# EAGLE design Hybrid Driver (EAGLE 8.5.2)
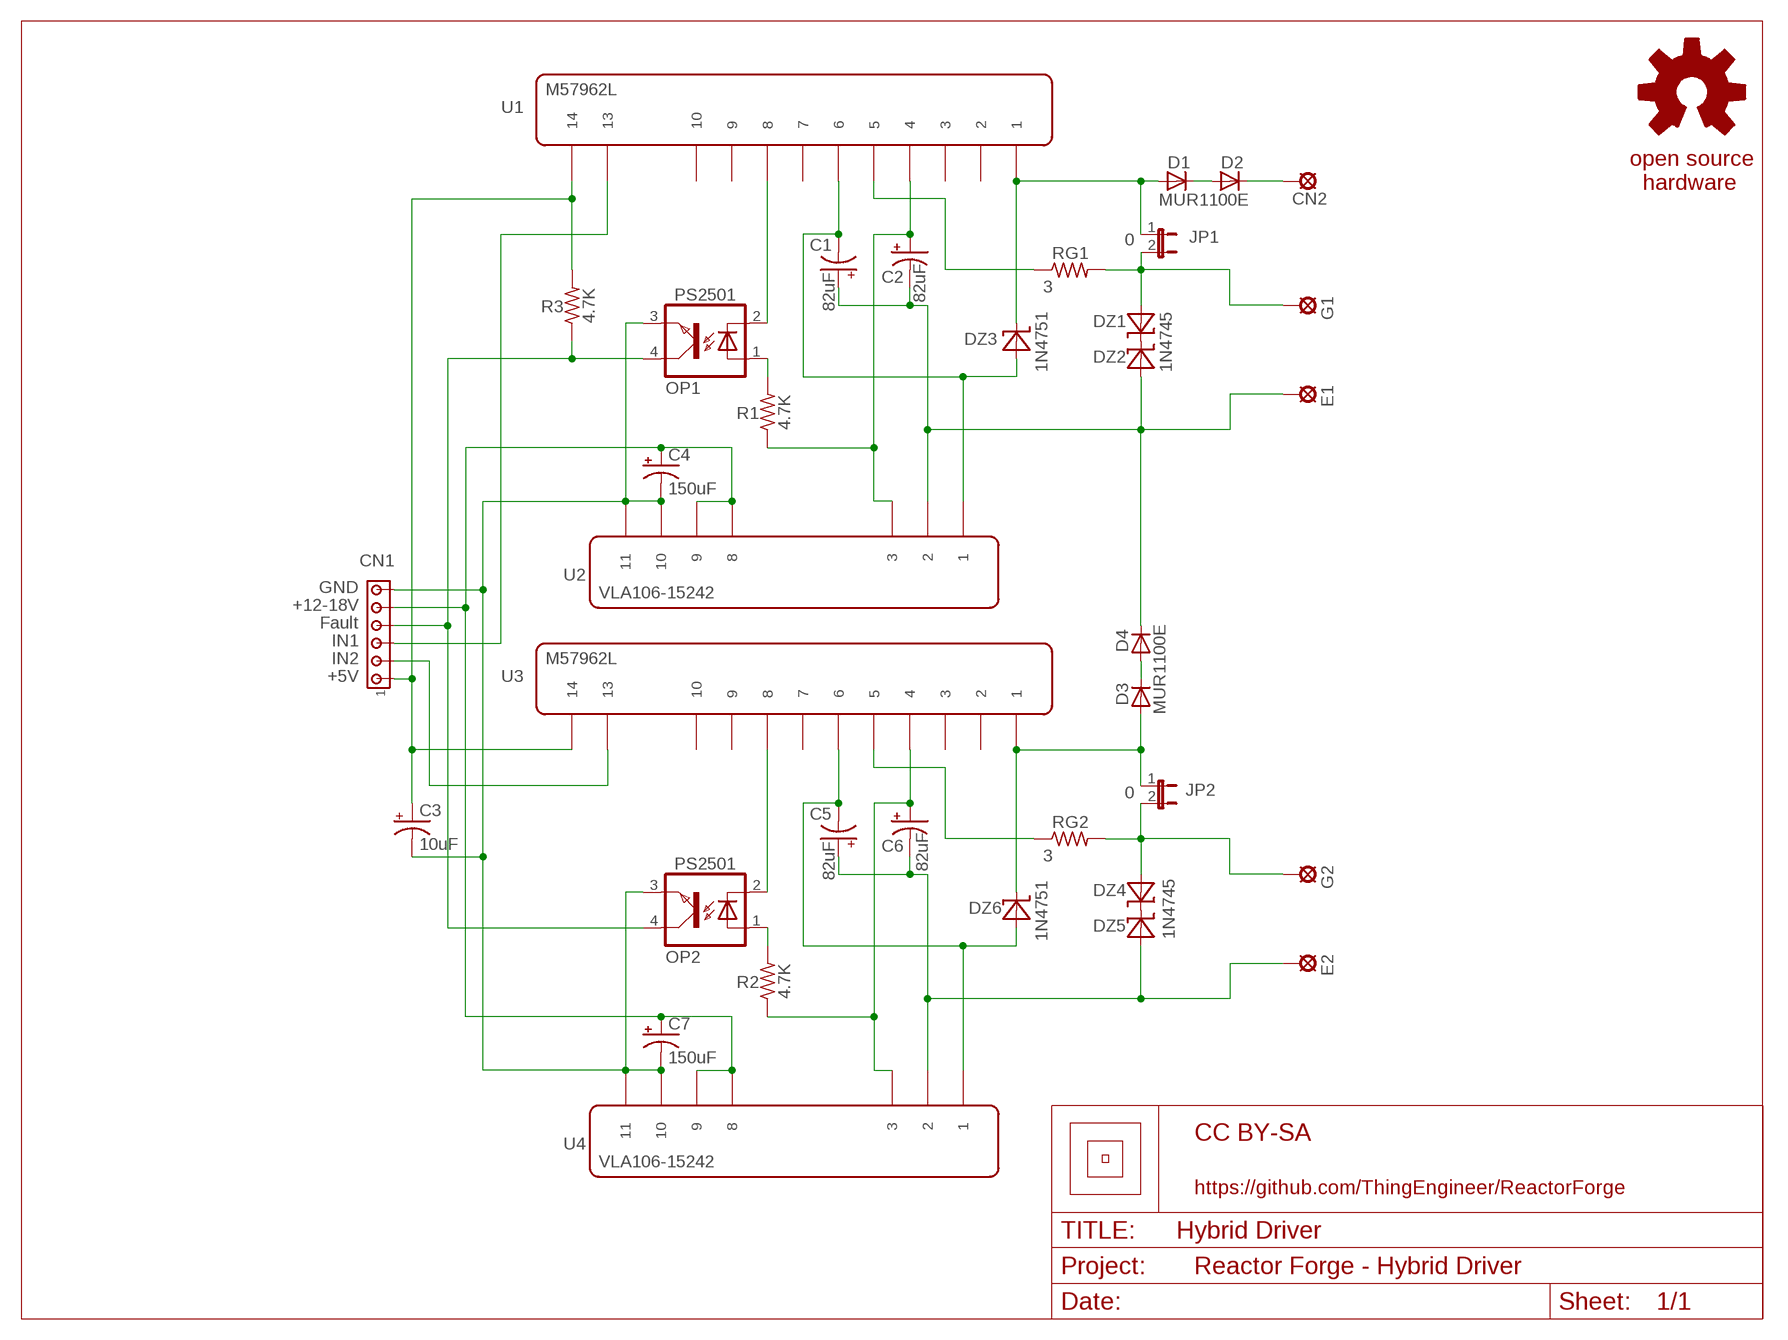
[diagram p0: schematic, sheet 1]
U$2 (LETTER_L): LICENSE: CC BY-SA; PROJECT: Reactor Forge - Hybrid Driver; URL: https://github.com/ThingEngineer/ReactorForge

## Parts
C1  82uF  CPOL-USE2.5-7  [E2,5-7]
C2  82uF  CPOL-USE2.5-7  [E2,5-7]
C3  10uF  CPOL-USE2-5  [E2-5]
C4  150uF  CPOL-USE5-8.5  [E5-8,5]
C5  82uF  CPOL-USE2.5-7  [E2,5-7]
C6  82uF  CPOL-USE2.5-7  [E2,5-7]
C7  150uF  CPOL-USE5-8.5  [E5-8,5]
CN1  MTA100-6  MTA06-100  [10X06MTA]
CN2  SE14  [SE14]
D1  MUR1100E  OA95  [DO07]
D2  MUR1100E  OA95  [DO07]
D3  MUR1100E  OA95  [DO07]
D4  MUR1100E  OA95  [DO07]
DZ1  1N4745  1N5338  [DIODE.4-AXIAL]
DZ2  1N4745  1N5338  [DIODE.4-AXIAL]
DZ3  1N4751  1N5338  [DIODE.4-AXIAL]
DZ4  1N4745  1N5338  [DIODE.4-AXIAL]
DZ5  1N4745  1N5338  [DIODE.4-AXIAL]
DZ6  1N4751  1N5338  [DIODE.4-AXIAL]
E1  IGBT-PAD  [IGBT-PAD]
E2  IGBT-PAD  [IGBT-PAD]
G1  IGBT-PAD  [IGBT-PAD]
G2  IGBT-PAD  [IGBT-PAD]
GOLD_ORB_SM1  OSHWLOGOLOGO8MM  [OSHW_8MM]
JP1  0  JP1E  [JP1]
JP2  0  JP1E  [JP1]
OP1  PS2501  PC817  [DIL04]
OP2  PS2501  PC817  [DIL04]
R1  4.7K  R-US_0207/10  [0207/10]
R2  4.7K  R-US_0207/10  [0207/10]
R3  4.7K  R-US_0207/10  [0207/10]
RG1  3  R-US_0309/12  [0309/12]
RG2  3  R-US_0309/12  [0309/12]
U1  M57962L  VLA504-01  [HYBRID-IC-IBGT-GATE-DRIVER]
U2  VLA106-15242  [ISOLATED_DC_DC_CONVERTER]
U3  M57962L  VLA504-01  [HYBRID-IC-IBGT-GATE-DRIVER]
U4  VLA106-15242  [ISOLATED_DC_DC_CONVERTER]

## Nets
G1: DZ1.A G1.1 G1.2 G1.3 G1.4 G1.5 G1.6 JP1.2 RG1.2
G2: DZ4.A G2.1 G2.2 G2.3 G2.4 G2.5 G2.6 JP2.2 RG2.2
GND: C3.- C4.- C7.- CN1.1 OP1.3(EMIT) OP2.3(EMIT) U2.10 U2.11 U4.10 U4.11
GND-E1: C1.+ C2.- D4.C DZ2.A E1.1 E1.2 E1.3 E1.4 E1.5 E1.6 U2.2
GND-E2: C5.+ C6.- DZ5.A E2.1 E2.2 E2.3 E2.4 E2.5 E2.6 U4.2
N$2: D1.C D2.A
N$3: CN2.MP D2.C
N$4: D1.A DZ3.C JP1.1 U1.1
N$6: OP2.1(A) R2.2
N$7: DZ1.C DZ2.C
N$8: DZ4.C DZ5.C
N$9: C3.+ CN1.6 R3.2 U1.14 U3.14
N$10: OP2.2(C) U3.8
N$11: OP1.2(C) U1.8
N$12: OP1.1(A) R1.2
N$13: CN1.3 OP1.4(COL) OP2.4(COL) R3.1
N$14 [power]: C5.- DZ6.A U3.6 U4.1
N$15 [power]: C1.- DZ3.A U1.6 U2.1
N$16: C2.+ R1.1 U1.4 U2.3
N$18: RG2.1 U3.5
N$19: C6.+ R2.1 U3.4 U4.3
N$21: RG1.1 U1.5
N$22: D3.A DZ6.C JP2.1 U3.1
N$25: D3.C D4.A
N$30 [power]: C4.+ C7.+ CN1.2 U2.8 U2.9 U4.8 U4.9
N$31: CN1.4 U1.13
N$32: CN1.5 U3.13
Unconnected: U1.2 U1.3 U1.7 U1.9 U1.10 U3.2 U3.3 U3.7 U3.9 U3.10

## Notes on the sheet
- GND
- +12-18V
- Fault
- IN1
- IN2
- +5V

## Library data of the parts
C1 C2 C4-C7 = resistor:CPOL-US: POLARIZED CAPACITOR, American symbol
C3 = rcl:CPOL-US: POLARIZED CAPACITOR, American symbol; SPICEPREFIX: C
CN1 = con-amp:MTA06-100: AMP connector
CN2 = solpad:SE14: SOLDER PAD E1553, drill 1,4mm, distributor Buerklin, 07F820
D1-D4 = diode:OA95: DIODE germanium diode 115 V, 50 mA/150 mA
DZ1-DZ6 = 1-Custom:1N5338: 1N5338 5.1V Zener Diode
E1 E2 G1 G2 = 1-Custom:IGBT-PAD
GOLD_ORB_SM1 = oshw:OSHWLOGO: The OSHW logo for PCB layout
JP1 JP2 = jumper:JP1E: JUMPER
OP1 OP2 = optocoupler:PC817: SHARP OPTO COUPLER; MPN: PC817X4J000F; OC_FARNELL: 9707727; OC_NEWARK: 97K7059
R1-R3 RG1 RG2 = resistor:R-US_: RESISTOR, American symbol
U1 U3 = 1-Custom:VLA504-01: VLA504-01 Hybrid IC IGBT Gate Driver 600V module up to 200A 1200V module up to 100A
U2 U4 = 1-Custom:VLA106-15242: VLA106-15252 Isolated DC/DC Converter Input: 12-18V Output: +24, 100mA (2.4W) 2500Vrms isolation

## Net classes
0 default: width 0.406 mm
1 power: width 0.508 mm

## Board
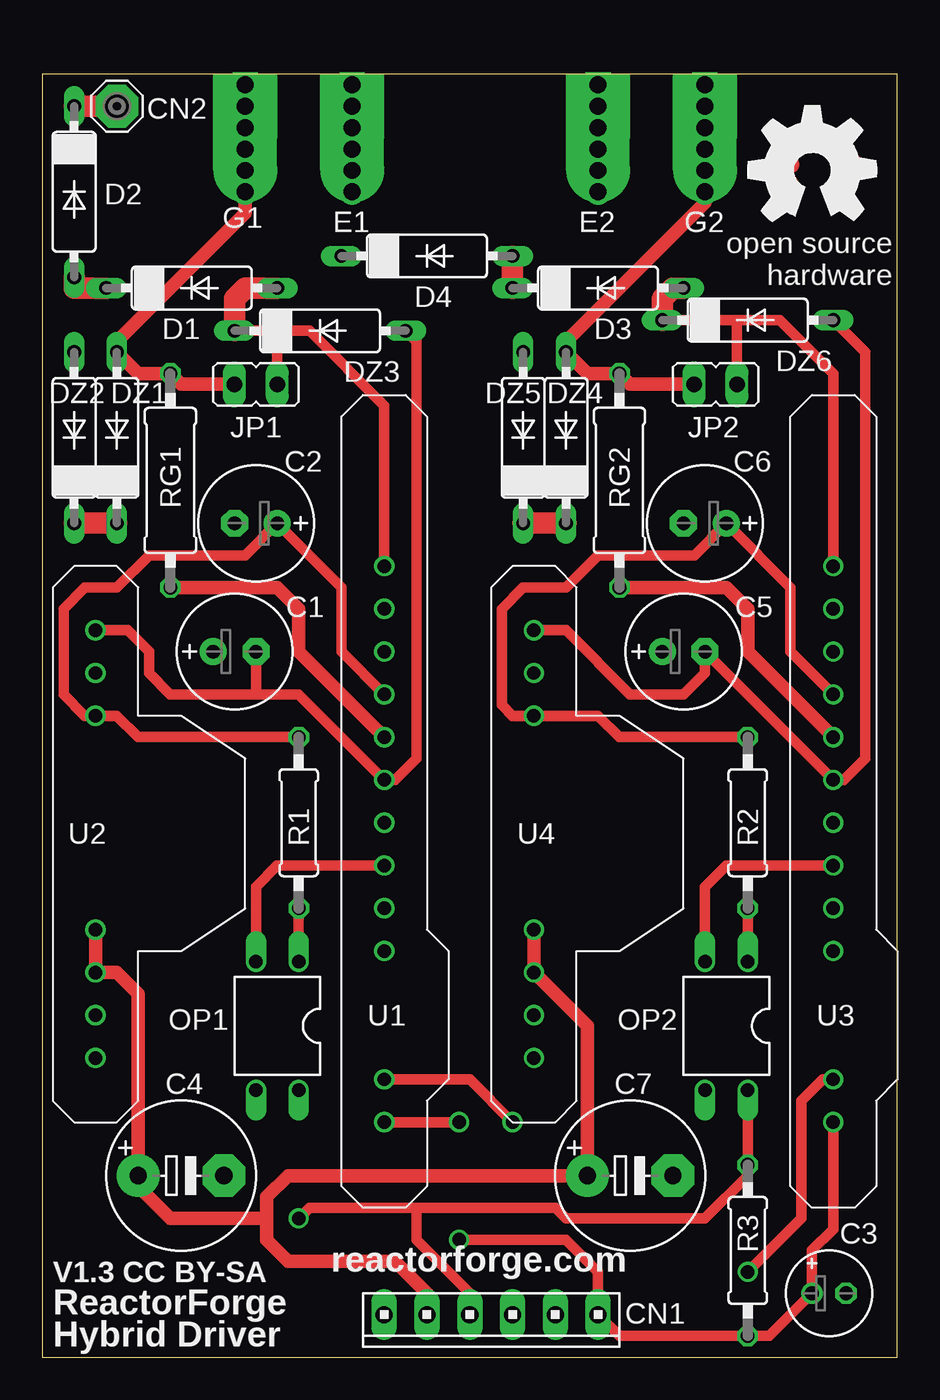
[diagram p1: board, top side]
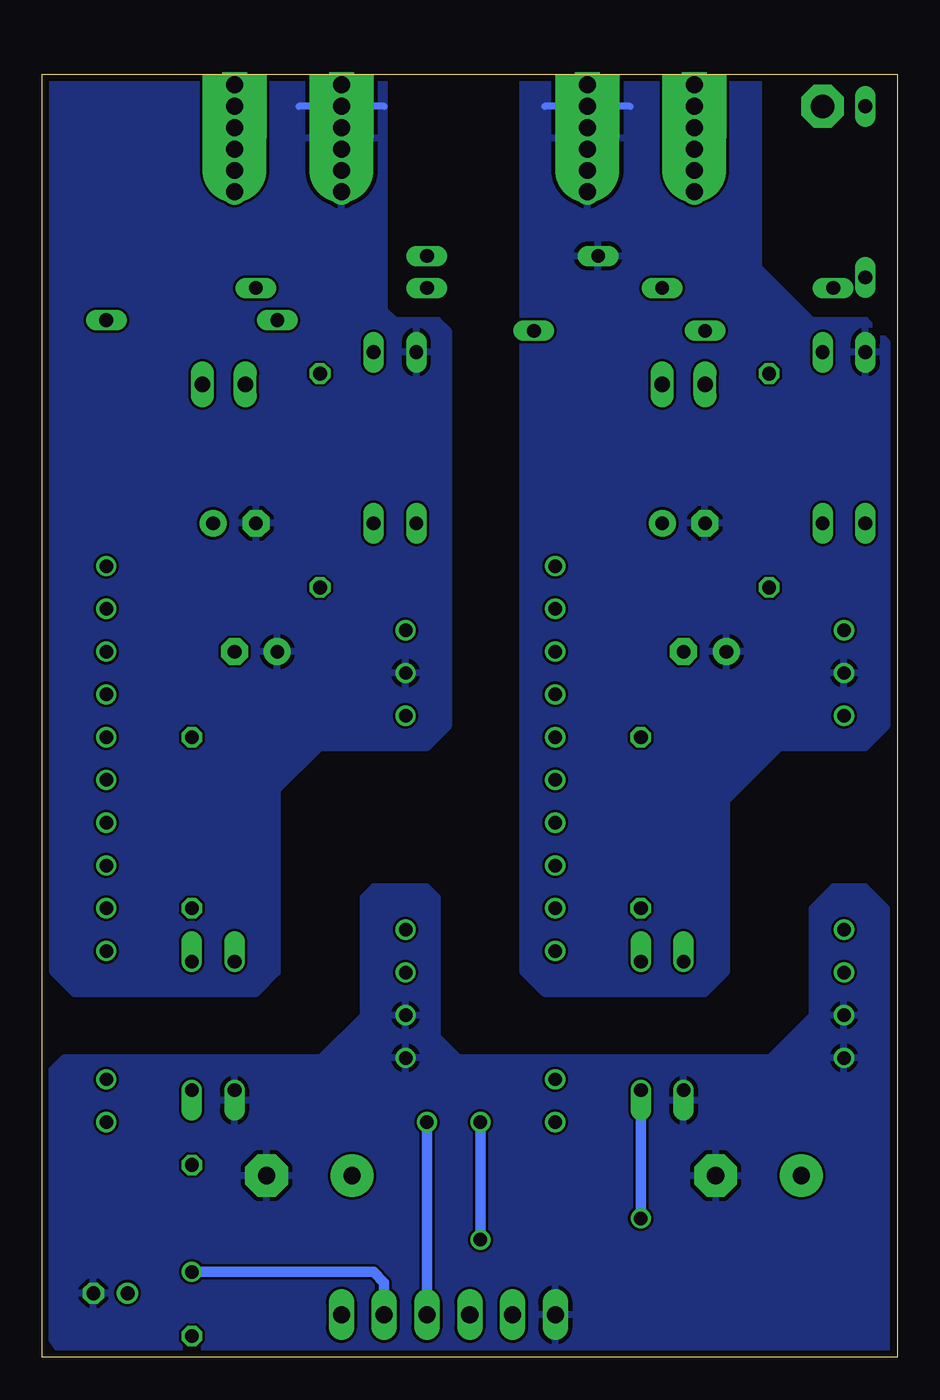
[diagram p2: board, bottom side, seen from below]

Size 50.8 x 76.2 mm. Coordinates in mm from the lower left corner, seen from the top.
Outline: 0,0 50.8,0 50.8,76.2 0,76.2 0,0
Copper layers (1*16): Top 0.035559375mm / dielectric 1.6mm / Bottom 0.035559375mm
Design rules "oshpark-2layer": minimum track width 6mil, minimum drill 10mil, track to track 6mil, track to pad 6mil, pad to pad 6mil, via to via 6mil, smd to smd 6mil, copper to edge 15mil, drill to drill 6mil, minimum pad ring 5mil, minimum via ring 5mil, stop-mask expansion 2.5mil, vias tented up to drill 0mil, thermal gap 10mil

### Footprints (pad centres in the part's own frame; a part is rotated, then mirrored left to right if it is on the bottom)
E2,5-7 = drill 0.813 pad 1.6: + -1.27,0 | drill 0.813 pad 1.6 octagon: - 1.27,0
E2-5 = drill 0.813 pad 1.27: + -1.016,0 | drill 0.813 pad 1.27 octagon: - 1.016,0
E5-8,5 = drill 1.016 pad 2.54: + -2.54,0 | drill 1.016 pad 2.54 octagon: - 2.54,0
10X06MTA = drill 1.016 long: 1 6.35,0; 2 3.81,0; 3 1.27,0; 4 -1.27,0; 5 -3.81,0; 6 -6.35,0
SE14 = drill 1.397 pad 2.54 octagon: MP 0,0
DO07 = drill 0.813 long: A 5.08,0; C -5.08,0
DIODE.4-AXIAL = drill 0.813 long: A 5.08,0; C -5.08,0
IGBT-PAD = drill 1 pad 1.27: 1 0,-1.27 | drill 1 pad 3.81 offset: 2 0,0 | drill 1 pad 1.27 square: 3 0,1.27; 4 0,2.54; 6 0,5.08 | drill 1 pad 3.81 square: 5 0,3.81
JP1 = drill 0.914 long: 1 0,-1.27; 2 0,1.27
DIL04 = drill 0.813 offset: 1 -1.27,-3.81; 2 1.27,-3.81; 3 1.27,3.81; 4 -1.27,3.81
0207/10 = drill 0.813 octagon: 1 -5.08,0; 2 5.08,0
0309/12 = drill 0.813 octagon: 1 -6.35,0; 2 6.35,0
HYBRID-IC-IBGT-GATE-DRIVER = drill 0.8: 1 10.16,3.81; 2 12.7,3.81; 3 15.24,3.81; 4 17.78,3.81; 5 20.32,3.81; 6 22.86,3.81; 7 25.4,3.81; 8 27.94,3.81; 9 30.48,3.81; 10 33.02,3.81; 13 40.64,3.81; 14 43.18,3.81
ISOLATED_DC_DC_CONVERTER = drill 0.8: 1 3.81,3.81; 2 6.35,3.81; 3 8.89,3.81; 8 21.59,3.81; 9 24.13,3.81; 10 26.67,3.81; 11 29.21,3.81

### Placement (x,y rotation side)
C1  11.43,41.91 0 top
C2  12.7,49.53 180 top
C3  46.74,3.81 0 top
C4  8.26,10.79 0 top
C5  38.1,41.91 0 top
C6  39.37,49.53 180 top
C7  34.92,10.79 0 top
CN1  26.67,2.54 180 top
CN2  4.45,74.3 0 top
D1  8.89,63.5 0 top
D2  1.91,69.22 270 top
D3  33.02,63.5 0 top
D4  22.86,65.41 0 top
DZ1  4.45,54.61 90 top
DZ2  1.91,54.61 90 top
DZ3  16.51,60.96 0 top
DZ4  31.11,54.61 90 top
DZ5  28.57,54.61 90 top
DZ6  41.91,61.59 0 top
E1  18.41,70.48 0 top
E2  33.02,70.48 0 top
G1  12.06,70.48 0 top
G2  39.37,70.48 0 top
GOLD_ORB_SM1  45.72,70.48 0 top
JP1  12.7,57.78 90 top
JP2  40.01,57.78 90 top
OP1  13.97,19.68 180 top
OP2  40.64,19.68 180 top
R1  15.24,31.75 270 top
R2  41.91,31.75 270 top
R3  41.91,6.35 270 top
RG1  7.62,52.07 90 top
RG2  34.29,52.07 90 top
U1  16.51,57.15 270 top
U2  -0.64,46.99 270 top
U3  43.18,57.15 270 top
U4  25.4,46.99 270 top

### Tracks (layer width: path | path; a pad name or v marks a point on that pad's centre or on a via)
G1
  Top 0.61: G1.1 G1.2 G1.3 G1.4 G1.5 G1.6
  Top 0.813: JP1.2 8.26,57.78 RG1.2 5.71,58.42 DZ1.A 4.45,60.33 12.06,67.94 G1.1
G2
  Top 0.61: G2.1 G2.2 G2.3 G2.4 G2.5 G2.6
  Top 0.813: JP2.2 34.92,57.78 RG2.2 32.38,58.42 DZ4.A 31.11,60.33 39.37,68.58 G2.1
GND
  pour Bottom: 34.29,17.78 49.53,17.78 50.8,16.51 50.8,1.91 49.53,0 0.64,0 0.64,26.67 1.91,27.94 3.81,27.94 5.08,26.67 5.08,20.32 7.62,17.78 26.04,17.78 27.3,19.05 27.3,27.3 27.94,27.94 31.11,27.94 31.75,27.3 31.75,20.32
GND-E1
  Bottom 0.406: 15.88,74.3 20.95,74.3
  pour Bottom: 11.43,21.59 20.95,21.59 22.23,22.86 22.23,76.2 8.26,76.2 8.26,64.77 5.08,61.59 1.91,61.59 0.64,60.33 0.64,37.47 1.91,36.2 6.99,36.2 10.16,33.02 10.16,22.86
GND-E2
  Bottom 0.406: 30.48,74.3 35.56,74.3
  pour Bottom: 36.83,33.66 36.83,22.86 38.1,21.59 48.9,21.59 50.16,22.86 50.16,76.2 30.48,76.2 30.48,62.23 29.84,61.59 27.3,61.59 26.67,60.96 26.67,37.47 27.94,36.2 34.29,36.2
N$2
  Top 1.27: D2.A 1.91,63.5 D1.C
N$3
  Top 1.27: CN2.MP D2.C
N$4
  Top 0.61: U1.1 20.32,56.52 15.88,60.96 13.97,60.96 | 13.97,60.96 DZ3.C | JP1.1 13.97,60.96
  Top 1.27: D1.A 12.06,63.5 11.43,62.87 DZ3.C
N$6
  Top 0.61: R2.2 OP2.1
N$7
  Top 1.27: DZ2.C DZ1.C
N$8
  Top 1.27: DZ4.C DZ5.C
N$9  (via drill 0.8)
  Top 0.61: v24.77,6.99 31.11,6.99 33.02,5.08 CN1.6 34.29,1.27 R3.2 43.18,1.27 C3.+ 45.72,6.35 46.99,7.62 U3.14 | U1.14 v24.77,13.97
  Bottom 0.61: v24.77,13.97 v24.77,6.99
N$10
  Top 0.61: OP2.2 39.37,27.94 40.64,29.21 U3.8
N$11
  Top 0.61: U1.8 13.97,29.21 12.7,27.94 OP1.2
N$12
  Top 0.61: R1.2 OP1.1
N$13  (via drill 0.8)
  Top 0.61: OP2.4 R3.1 41.91,10.79 39.37,8.26 31.11,8.26 30.48,8.89 22.23,8.89 | CN1.3 25.4,3.81 22.23,6.99 22.23,8.89 | 22.23,8.89 15.88,8.89 v15.24,8.26
  Bottom 0.61: OP1.4 v15.24,8.26
N$14
  Top 0.61: U4.1 31.11,43.18 34.92,39.37 38.1,39.37 39.37,40.64 C5.- U3.6 47.62,34.29 48.9,35.56 48.9,59.69 DZ6.A
N$15
  Top 0.61: U2.1 5.08,43.18 6.35,41.91 6.35,40.64 7.62,39.37 12.7,39.37 | C1.- 12.7,39.37 | 12.7,39.37 15.24,39.37 U1.6 20.95,34.29 22.23,35.56 22.23,60.33 DZ3.A
N$16
  Top 0.61: R1.1 5.71,36.83 4.45,38.1 U2.3 2.54,38.1 1.27,39.37 1.27,44.45 2.54,45.72 4.45,45.72 6.35,47.62 12.06,47.62 C2.+ 17.78,45.72 17.78,41.91 U1.4
N$18
  Top 0.813: U3.5 41.91,41.91 41.91,44.45 40.64,45.72 RG2.1
N$19
  Top 0.61: R2.1 34.29,36.83 33.02,38.1 U4.3 27.94,38.1 27.3,38.73 27.3,44.45 28.57,45.72 31.11,45.72 33.02,47.62 38.73,47.62 C6.+ 44.45,45.72 44.45,41.91 U3.4
N$21
  Top 0.813: U1.5 15.24,41.91 15.24,44.45 13.97,45.72 RG1.1
N$22
  Top 0.61: U3.1 46.99,58.42 43.81,61.59 41.27,61.59 | 41.27,61.59 DZ6.C | JP2.1 41.27,61.59
  Top 1.27: DZ6.C 36.83,62.87 37.47,63.5 D3.A
N$25
  Top 1.27: D3.C D4.A
N$30
  Top 0.813: 13.34,8.26 13.34,9.53 14.61,10.79 C7.+ 32.38,19.68 U4.9 U4.8 | 13.34,8.26 13.34,6.99 14.61,5.71 20.95,5.71 22.86,3.81 CN1.2 | 13.34,8.26 7.62,8.26 5.71,10.16 C4.+ 5.71,21.59 4.45,22.86 U2.9 U2.8
N$31  (via drill 0.8)
  Top 0.61: U1.13 25.4,16.51 v27.94,13.97
  Bottom 0.61: CN1.4 v27.94,13.97
N$32  (via drill 0.8)
  Top 0.61: U3.13 46.35,16.51 45.09,15.24 45.09,8.26 v41.91,5.08
  Bottom 0.61: CN1.5 30.48,4.45 31.11,5.08 v41.91,5.08

### Text on the board
Top: R | F
tPlace: reactorforge.com | V1.3 CC BY-SA | ReactorForge | Hybrid Driver